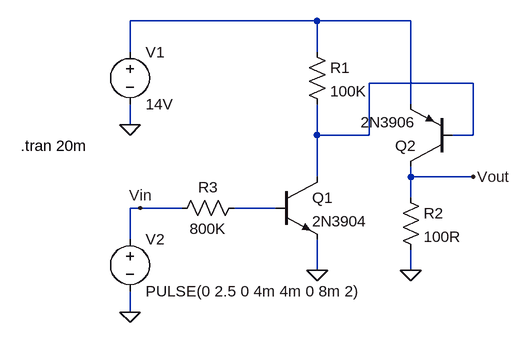
[diagram p0: schematic PNP & NPN Voltage Amplifier.asc]
PNP & NPN Voltage Amplifier.asc, the LTspice schematic file:
Version 4
SHEET 1 880 680
WIRE 320 -80 32 -80
WIRE 464 -80 320 -80
WIRE 32 -32 32 -80
WIRE 320 -32 320 -80
WIRE 560 16 400 16
WIRE 464 48 464 -80
WIRE 32 80 32 48
WIRE 320 96 320 48
WIRE 400 96 400 16
WIRE 400 96 320 96
WIRE 560 96 560 16
WIRE 560 96 528 96
WIRE 320 160 320 96
WIRE 464 160 464 144
WIRE 560 160 464 160
WIRE 464 192 464 160
WIRE 48 208 32 208
WIRE 112 208 48 208
WIRE 256 208 192 208
WIRE 32 256 32 208
WIRE 320 304 320 256
WIRE 464 304 464 272
WIRE 32 368 32 336
FLAG 32 80 0
FLAG 320 304 0
FLAG 464 304 0
FLAG 32 368 0
FLAG 560 160 Vout
FLAG 48 208 Vin
SYMBOL npn 256 160 R0
SYMATTR InstName Q1
SYMATTR Value 2N3904
SYMBOL pnp 528 144 R180
SYMATTR InstName Q2
SYMATTR Value 2N3906
SYMBOL res 304 -48 R0
SYMATTR InstName R1
SYMATTR Value 100K
SYMBOL voltage 32 -48 R0
WINDOW 123 0 0 Left 0
WINDOW 39 0 0 Left 0
SYMATTR InstName V1
SYMATTR Value 14V
SYMBOL voltage 32 240 R0
WINDOW 123 0 0 Left 0
WINDOW 39 0 0 Left 0
SYMATTR InstName V2
SYMATTR Value PULSE(0 2.5 0 4m 4m 0 8m 2)
SYMBOL res 448 176 R0
SYMATTR InstName R2
SYMATTR Value 100R
SYMBOL res 208 192 R90
WINDOW 0 0 56 VBottom 2
WINDOW 3 32 56 VTop 2
SYMATTR InstName R3
SYMATTR Value 800K
TEXT -136 112 Left 2 !.tran 20m

The netlist it stands for:
* PNP & NPN Voltage Amplifier.asc
Q1 N002 N003 0 0 2N3904
Q2 Vout N002 N001 0 2N3906
R1 N001 N002 100K
V1 N001 0 14V
V2 Vin 0 PULSE(0 2.5 0 4m 4m 0 8m 2)
R2 Vout 0 100R
R3 N003 Vin 800K
.model NPN NPN
.model PNP PNP
.lib standard.bjt
.tran 20m
.backanno
.end